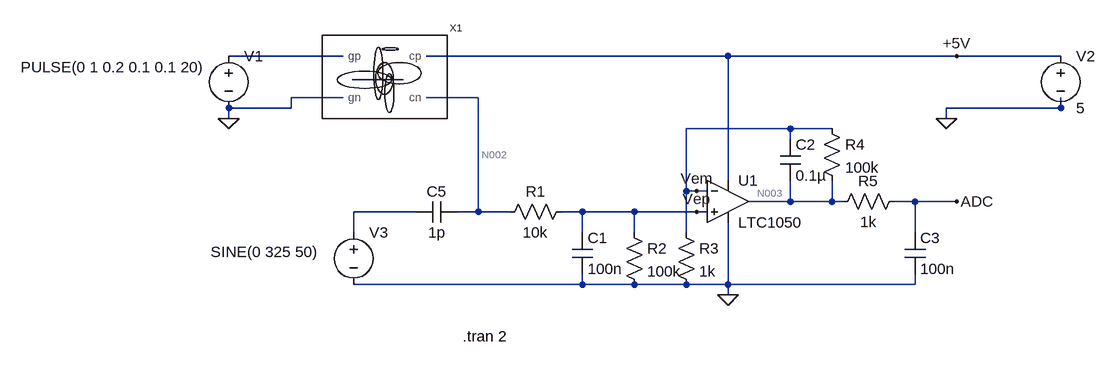
[diagram p0: schematic Ampli_transimpédance.asc]
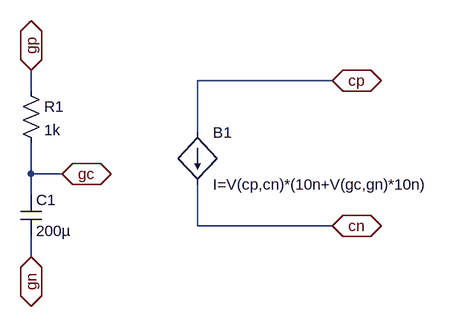
[diagram p1: sub-circuit capteur_graphène.asc]
Ampli_transimpédance.asc, the LTspice schematic file:
Version 4
SHEET 1 1168 680
WIRE -16 -144 -192 -144
WIRE 576 -144 112 -144
WIRE 928 -144 576 -144
WIRE 1088 -144 928 -144
WIRE -16 -80 -96 -80
WIRE 192 -80 112 -80
WIRE -96 -64 -96 -80
WIRE -96 -64 -192 -64
WIRE 1088 -64 1088 -80
WIRE 1088 -64 912 -64
WIRE -192 -48 -192 -64
WIRE 912 -48 912 -64
WIRE 672 -32 512 -32
WIRE 736 -32 672 -32
WIRE 672 -16 672 -32
WIRE 576 48 576 -144
WIRE 512 64 512 -32
WIRE 528 64 512 64
WIRE 544 64 528 64
WIRE 672 80 672 48
WIRE 672 80 608 80
WIRE 736 80 736 48
WIRE 736 80 672 80
WIRE 752 80 736 80
WIRE 864 80 832 80
WIRE 928 80 864 80
WIRE 96 96 0 96
WIRE 192 96 192 -80
WIRE 192 96 160 96
WIRE 240 96 192 96
WIRE 352 96 320 96
WIRE 432 96 352 96
WIRE 528 96 432 96
WIRE 544 96 528 96
WIRE 0 128 0 96
WIRE 352 128 352 96
WIRE 432 128 432 96
WIRE 512 128 512 64
WIRE 864 128 864 80
WIRE 352 208 352 192
WIRE 352 208 0 208
WIRE 432 208 352 208
WIRE 512 208 432 208
WIRE 576 208 576 112
WIRE 576 208 512 208
WIRE 864 208 864 192
WIRE 864 208 576 208
WIRE 576 224 576 208
FLAG 576 224 0
FLAG 912 -48 0
FLAG 928 80 ADC
FLAG 928 -144 +5V
FLAG 528 64 Vem
FLAG 528 96 Vep
FLAG -192 -48 0
SYMBOL res 336 80 R90
WINDOW 0 0 56 VBottom 2
WINDOW 3 32 56 VTop 2
SYMATTR InstName R1
SYMATTR Value 10k
SYMBOL cap 336 128 R0
SYMATTR InstName C1
SYMATTR Value 100n
SYMBOL res 416 112 R0
SYMATTR InstName R2
SYMATTR Value 100k
SYMBOL res 496 112 R0
SYMATTR InstName R3
SYMATTR Value 1k
SYMBOL OpAmps\\LTC1050 576 16 R0
SYMATTR InstName U1
SYMBOL cap 656 -16 R0
SYMATTR InstName C2
SYMATTR Value 0.1µ
SYMBOL res 720 -48 R0
SYMATTR InstName R4
SYMATTR Value 100k
SYMBOL res 848 64 R90
WINDOW 0 0 56 VBottom 2
WINDOW 3 32 56 VTop 2
SYMATTR InstName R5
SYMATTR Value 1k
SYMBOL cap 848 128 R0
SYMATTR InstName C3
SYMATTR Value 100n
SYMBOL voltage 1088 -160 R0
WINDOW 123 24 44 Left 2
WINDOW 39 0 0 Left 0
SYMATTR InstName V2
SYMATTR Value 5
SYMBOL voltage -192 -160 R0
WINDOW 3 -320 33 Left 2
WINDOW 123 24 44 Left 2
WINDOW 39 0 0 Left 0
SYMATTR Value PULSE(0 1 0.2 0.1 0.1 20)
SYMATTR InstName V1
SYMBOL voltage 0 112 R0
WINDOW 3 -220 46 Left 2
WINDOW 123 0 0 Left 0
WINDOW 39 0 0 Left 0
SYMATTR Value SINE(0 325 50)
SYMATTR InstName V3
SYMBOL cap 160 80 R90
WINDOW 0 0 32 VBottom 2
WINDOW 3 32 32 VTop 2
SYMATTR InstName C5
SYMATTR Value 1p
SYMBOL capteur_graphène 32 -128 R0
SYMATTR InstName X1
TEXT 168 288 Left 2 !.tran 2

capteur_graphène.asc, the sub-circuit schematic file:
Version 4
SHEET 1 880 680
WIRE 416 32 208 32
WIRE -48 48 -48 16
WIRE 208 112 208 32
WIRE -48 176 -48 128
WIRE 0 176 -48 176
WIRE -48 208 -48 176
WIRE 208 256 208 192
WIRE 416 256 208 256
WIRE -48 304 -48 272
FLAG 416 32 cp
IOPIN 416 32 BiDir
FLAG 416 256 cn
IOPIN 416 256 BiDir
FLAG -48 16 gp
IOPIN -48 16 BiDir
FLAG -48 304 gn
IOPIN -48 304 BiDir
FLAG 0 176 gc
IOPIN 0 176 BiDir
SYMBOL bi 208 112 R0
SYMATTR InstName B1
SYMATTR Value I=V(cp,cn)*(10n+V(gc,gn)*10n)
SYMBOL res -64 32 R0
SYMATTR InstName R1
SYMATTR Value 1k
SYMBOL cap -64 208 R0
SYMATTR InstName C1
SYMATTR Value 200µ

The netlist it stands for:
* Ampli_transimpédance.asc
R1 Vep N002 10k
C1 Vep 0 100n
R2 Vep 0 100k
R3 Vem 0 1k
XU1 Vep Vem +5V 0 N003 LTC1050  ; pins In+ In- V+ V- OUT
C2 Vem N003 0.1µ
R4 Vem N003 100k
R5 ADC N003 1k
C3 ADC 0 100n
V2 +5V 0 5
V1 N001 0 PULSE(0 1 0.2 0.1 0.1 20)
V3 N004 0 SINE(0 325 50)
C5 N002 N004 1p
XX1 N001 0 +5V N002 capteur_graphène

* block symbol definitions
.subckt capteur_graphène gp gn cp cn
B1 cp cn I=V(cp,cn)*(10n+V(gc,gn)*10n)
R1 gp gc 1k
C1 gc gn 200µ
.ends capteur_graphène

.tran 2
.lib LTC.lib
.backanno
.end

* Results of the author's LTspice run, read from the files saved beside the schematic
* Operating Point, zero values left out:
*   V(vep) = 4.995 mV
*   V(n002) = 5.494 mV
*   V(vem) = 4.995 mV
*   V(+5v) = 5 V
*   V(n003) = 504.4 mV
*   V(adc) = 504.4 mV
*   I(R1) = -49.95 nA
*   I(R2) = 49.95 nA
*   I(R3) = 4.995 µA
*   I(R4) = -4.995 µA
*   I(V2) = -754.2 µA
*   Ix(u1:3) = 754.1 µA
*   Ix(u1:4) = -749.1 µA
*   Ix(u1:5) = -4.995 µA
*   Ix(x1:CP) = 49.95 nA
*   Ix(x1:CN) = -49.95 nA
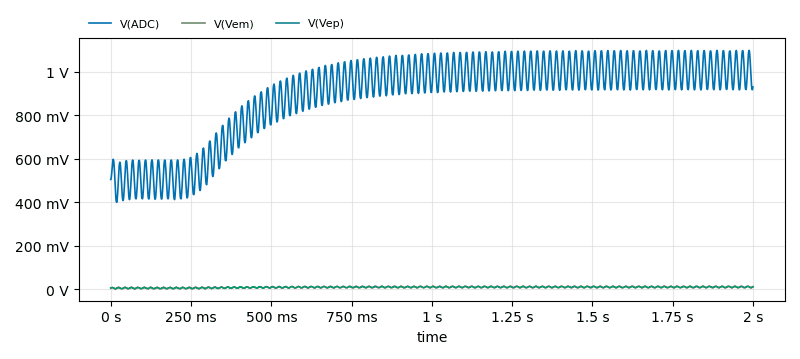
[diagram p2: Transient Analysis of Ampli_transimpédance.asc, plotted from the saved traces]
* Transient Analysis, 1 run:
*   V(ADC): min 399.5 mV, max 1.099 V, average 889.4 mV, rms 909.9 mV, last 930.6 mV
*   V(Vem): min 1.681 mV, max 13.06 mV, average 8.828 mV, rms 9.259 mV, last 10.91 mV
*   V(Vep): min 1.679 mV, max 13.06 mV, average 8.828 mV, rms 9.259 mV, last 10.91 mV